# Altium schematic sheet main_controller.SchDoc
size A4; SheetNumber: 3; SheetTotal: 4
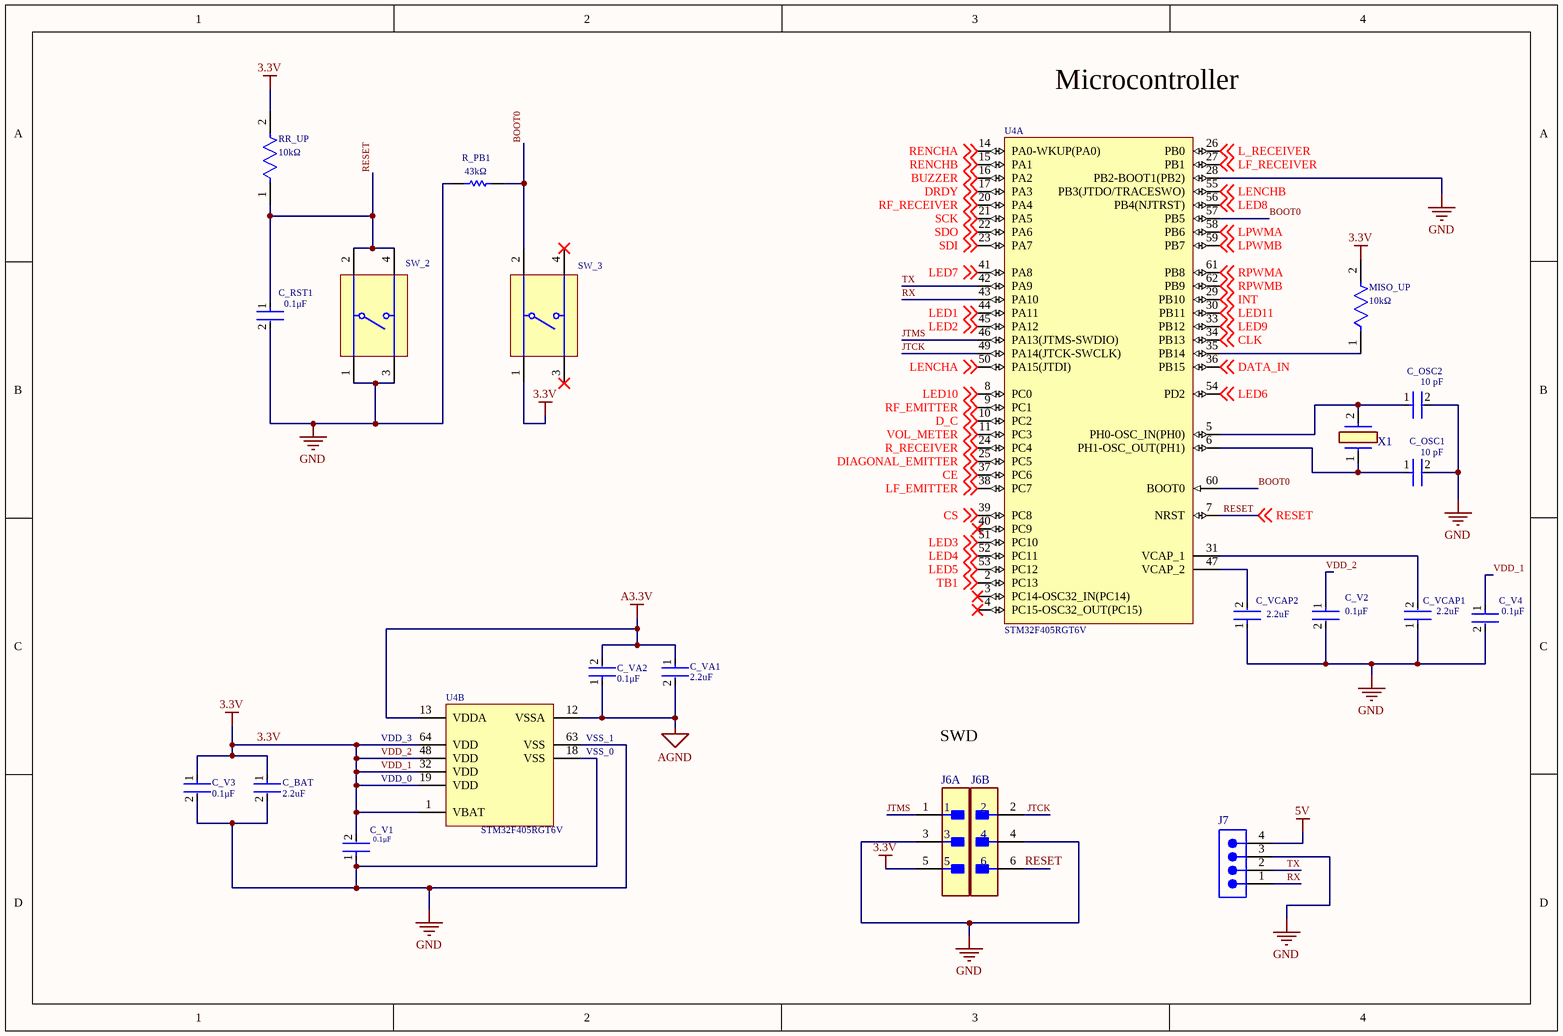
[diagram p0: main_controller.SchDoc]

## Parts
C_BAT  Capacitance: 2.2uF  [FP-C2012-125-0_2-IPC_C]  (hidden comment: C2012X5R1H225K125AB)
C_OSC1  value 10 pF  [FP-C0805C-DN-MFG]  (hidden comment: C0805C100K5GACTU)
C_OSC2  value 10 pF  [FP-C0805C-DN-MFG]  (hidden comment: C0805C100K5GACTU)
C_RST1  value 0.1μF  [FP-C0805C-DN-MFG]  (hidden comment: C0805C104J8RACTU)
C_V1  value 0.1μF  [FP-C0805C-DN-MFG]  (hidden comment: C0805C104J8RACTU)
C_V2  value 0.1μF  [FP-C0805C-DN-MFG]  (hidden comment: C0805C104J8RACTU)
C_V3  value 0.1μF  [FP-C0805C-DN-MFG]  (hidden comment: C0805C104J8RACTU)
C_V4  value 0.1μF  [FP-C0805C-DN-MFG]  (hidden comment: C0805C104J8RACTU)
C_VA1  Capacitance: 2.2uF  [FP-C2012-125-0_2-IPC_C]  (hidden comment: C2012X5R1H225K125AB)
C_VA2  value 0.1μF  [FP-C0805C-DN-MFG]  (hidden comment: C0805C104J8RACTU)
C_VCAP1  Capacitance: 2.2uF  [FP-C2012-125-0_2-IPC_C]  (hidden comment: C2012X5R1H225K125AB)
C_VCAP2  Capacitance: 2.2uF  [FP-C2012-125-0_2-IPC_C]  (hidden comment: C2012X5R1H225K125AB)
J6  90131-0763  [FP-90131-0763-MFG]  (value not drawn)  (parts A,B of 2)
J7  61300411121  [61300411121]  (value not drawn)
MISO_UP  value 10kΩ  [FP-ERA3A-IPC_C]  (hidden comment: ERA-3AEB103V)
R_PB1  value 43kΩ  [RESC1608X55X30NL20T20]  (hidden comment: ERA3AEB433V)
RR_UP  value 10kΩ  [FP-ERA3A-IPC_C]  (hidden comment: ERA-3AEB103V)
SW_2  1825910-6  [TECO-1825910-6_V]  (value not drawn)
SW_3  1825910-6  [TECO-1825910-6_V]  (value not drawn)
U4  STM32F405RGT6V  [STM-LQFP64_V]  (parts A,B of 2)
X1  NX5032GA-16.000M-LN-CD-1  [NX5032GA16000000MHZLNCD1]  (value not drawn)

## Nets
3.3V: C_BAT.1 C_V1.2 C_V2.1 C_V3.1 C_V4.1 J6.5 MISO_UP.2 RR_UP.2 SW_3.1 U4.1(VBAT) U4.19(VDD) U4.32(VDD) U4.48(VDD) U4.64(VDD)  [also labelled VDD_1, VDD_2]
5V: J7.4
A3.3V: C_VA1.1 C_VA2.2 U4.13(VDDA)
AGND: C_VA1.2 C_VA2.1 U4.12(VSSA)
GND: C_BAT.2 C_OSC1.2 C_OSC2.2 C_RST1.2 C_V1.1 C_V2.2 C_V3.2 C_V4.2 C_VCAP1.1 C_VCAP2.1 J6.3 J6.4 J7.3 R_PB1.2 SW_2.1 SW_2.3 U4.18(VSS) U4.28(PB2-BOOT1(PB2)) U4.63(VSS)
BOOT0: R_PB1.1 SW_3.2 U4.57(PB5) U4.60(BOOT0)
BUZZER: U4.16(PA2) ; off-sheet BUZZER
CE: U4.37(PC6) ; off-sheet CE
CLK: U4.34(PB13) ; off-sheet CLK
CS: U4.39(PC8) ; off-sheet CS
D_C: U4.10(PC2) ; off-sheet D_C
DATA_IN: U4.36(PB15) ; off-sheet DATA_IN
DIAGONAL_EMITTER: U4.25(PC5) ; off-sheet DIAGONAL_EMITTER
DRDY: U4.17(PA3) ; off-sheet DRDY
INT: U4.29(PB10) ; off-sheet INT
JTCK: J6.2 U4.49(PA14(JTCK-SWCLK))
JTMS: J6.1 U4.46(PA13(JTMS-SWDIO))
L_RECEIVER: U4.26(PB0) ; off-sheet L_RECEIVER
LED1: U4.44(PA11) ; off-sheet LED1
LED2: U4.45(PA12) ; off-sheet LED2
LED3: U4.51(PC10) ; off-sheet LED3
LED4: U4.52(PC11) ; off-sheet LED4
LED5: U4.53(PC12) ; off-sheet LED5
LED6: U4.54(PD2) ; off-sheet LED6
LED7: U4.41(PA8) ; off-sheet LED7
LED8: U4.56(PB4(NJTRST)) ; off-sheet LED8
LED9: U4.33(PB12) ; off-sheet LED9
LED10: U4.8(PC0) ; off-sheet LED10
LED11: U4.30(PB11) ; off-sheet LED11
LENCHA: U4.50(PA15(JTDI)) ; off-sheet LENCHA
LENCHB: U4.55(PB3(JTDO/TRACESWO)) ; off-sheet LENCHB
LF_EMITTER: U4.38(PC7) ; off-sheet LF_EMITTER
LF_RECEIVER: U4.27(PB1) ; off-sheet LF_RECEIVER
LPWMA: U4.58(PB6) ; off-sheet LPWMA
LPWMB: U4.59(PB7) ; off-sheet LPWMB
R_RECEIVER: U4.24(PC4) ; off-sheet R_RECEIVER
RENCHA: U4.14(PA0-WKUP(PA0)) ; off-sheet RENCHA
RENCHB: U4.15(PA1) ; off-sheet RENCHB
RESET: C_RST1.1 J6.6 RR_UP.1 SW_2.2 SW_2.4 U4.7(NRST) ; off-sheet RESET
RF_EMITTER: U4.9(PC1) ; off-sheet RF_EMITTER
RF_RECEIVER: U4.20(PA4) ; off-sheet RF_RECEIVER
RPWMA: U4.61(PB8) ; off-sheet RPWMA
RPWMB: U4.62(PB9) ; off-sheet RPWMB
RX: J7.1 U4.43(PA10)
SCK: U4.21(PA5) ; off-sheet SCK
SDI: U4.23(PA7) ; off-sheet SDI
SDO: U4.22(PA6) ; off-sheet SDO
TB1: U4.2(PC13) ; off-sheet TB1
TX: J7.2 U4.42(PA9)
VOL_METER: U4.11(PC3) ; off-sheet VOL_METER
NetC_OSC1_1: C_OSC1.1 U4.6(PH1-OSC_OUT(PH1)) X1.1(X1)
NetC_OSC2_1: C_OSC2.1 U4.5(PH0-OSC_IN(PH0)) X1.2(X2)
NetC_VCAP1_2: C_VCAP1.2 U4.31(VCAP_1)
NetC_VCAP2_2: C_VCAP2.2 U4.47(VCAP_2)
NetMISO_UP_1: MISO_UP.1 U4.35(PB14)

Not connected (* = marked no-connect by the designer): SW_3 3* 4*; U4 3(PC14-OSC32_IN(PC14))* 4(PC15-OSC32_OUT(PC15))* 40(PC9)*

## Notes on the sheet
- Microcontroller
- VDD_0
- (near U4) VDD_3
- (near U4) VSS_0
- (near U4) VSS_1
- SWD

## Library data of the parts
C_BAT C_VA1 C_VCAP1 C_VCAP2 = CMP-08246-005698-1: Multilayer Ceramic Capacitors 2.2μF ±10% 50V X5R SMD 0805; Insulation Resistance: 10GR; Dissipation Factor: 5%; Width: 1.2mm; Packaging: Tape and Reel; REACH SVHC: No SVHC; Dielectric: X5R; Dielectric Material: Ceramic; Voltage Rating: 50V; Radiation Hardening: No; Height: 1.25mm; Termination: SMD/SMT; Max Operating Temperature: 85°C; Resistor Type: Ceramic; Package Quantity: 1; Min Operating Temperature: -55°C; Weight: 0.000194oz; Thickness: 0.057inch; Lead Free: Lead Free; Tolerance: 10%; Voltage Rating (DC): 50V; RoHS Compliant: Yes; Construction: Flat; Mount: Surface Mount; Depth: 1.25mm; Length: 2mm; Case Code (Imperial): 0805; Case/Package: 0805; Series: C; Case Code (Metric): 2012
C_OSC1 C_OSC2 = CMP-2007-00462-2: CAP CER 10PF 50V 10% NP0 0805; Manufacturer: KEMET; Temperature Characteristic: C0G; Temperature Coefficient: 30ppm/°C; Tolerance: 0.1; Package: C0805C-DN; Device Class L2: Capacitors; Mouser Description: Multilayer Ceramic Capacitors MLCC - SMD/SMT 50volts 10pF C0G 10%; ComponentLink2URL: https://content.kemet.com/datasheets/KEM_C1003_C0G_SMD.pdf; Automotive: No; Device Class L3: Ceramic Capacitors; Temperature: -55°C to +125°C; Manufacturer Part Number: C0805C100K5GACTU; Digikey Description: CAP CER 10PF 50V 10% NP0 0805; Material: Ceramic; RoHS: TRUE; Temperature Range High: +125°C; Capacitance: 10 pF; Category: Cap; Voltage Rating: 50 V; Octopart: https://octopart.com/c0805c100k5gactu-kemet-8089747; Height: 0.88mm; Lead Free: Yes; Ipc Land Pattern Name: CAPC200125X78; Temperature Range Low: -55°C; Device Class L1: Passive Components; ComponentLink2Description: Datasheet
C_RST1 C_V1-C_V4 C_VA2 = CMP-03020-032188-1: CAP CER 0.1UF 10V 5% X7R 0805; Manufacturer: KEMET; Tolerance: 0.05; Capacitance: 0.10 μF; Temperature Coefficient: 30ppm/°C; Package: C0805C-DN; Device Class L1: Passive Components; Temperature: -55°C to +125°C; Category: Cap; RoHS: TRUE; Mouser Description: Multilayer Ceramic Capacitors MLCC - SMD/SMT 10volts 0.1uF X7R 5%; Lead Free: Yes; Temperature Range Low: -55°C; Material: Ceramic; Temperature Range High: +125°C; Device Class L2: Capacitors; Temperature Characteristic: X7R; Device Class L3: Ceramic Capacitors; ComponentLink2Description: Datasheet; Automotive: No; Ipc Land Pattern Name: CAPC200125X78; Manufacturer Part Number: C0805C104J8RACTU; Voltage Rating: 10 V; Height: 0.88mm; Digikey Description: CAP CER 0.1UF 10V 5% X7R 0805; Octopart: https://octopart.com/c0805c104j8ractu-kemet-11807087; ComponentLink2URL: https://content.kemet.com/datasheets/KEM_C1003_C0G_SMD.pdf
J6 = CMP-00257-00655468-1: 90131-0763 Conn Unshrouded Header HDR 6 POS 2.54mm Solder ST Top Entry Thru-Hole C-Grid III™ Tray; NexarPartId: 655468; Manufacturer Lifecycle Status: ACTIVE; Number of Poles: 6; Plating: Tin; Current Rating: 3A; Gender: Male; Voltage Rating (AC): 350V; Contact Resistance: 20mΩ; Insulation Resistance: 5GΩ; Pitch: 2.54mm; Height: 9.65mm; Mount: Through Hole; Termination: Through Hole; Contact Plating: Gold; Orientation: Vertical; Material: Glass, Polyester; Min Operating Temperature: -55°C; Lead Free: Lead Free; REACH SVHC: Unknown; Contact Material: Brass; Housing Color: Black; Schedule B: 8536694040; Number of Rows: 2; Lead Pitch: 2.54mm; Number of Circuits: 6; Number of Positions: 6; Lifecycle Status: Production; Max Operating Temperature: 125°C; Voltage Rating: 350V; Voltage Rating (DC): 350V; Country of Origin: SG; Housing Material: Polyester; RoHS: Compliant; Working Voltage: 350V; Number of Contacts: 6; Radiation Hardening: No
J7 = CMP-1502-01064-2: NexarPartId: 32855522; Pitch: 2.54mm; Number of Contacts: 4; Contact Resistance: 20mΩ; Gender: Male; Current Rating: 3A; Connector Type: Male Pin; Voltage Rating: 250V; Lead Free: Lead Free; Contact Plating: Gold; Max Operating Temperature: 105°C; Packaging: Bulk; Height: 8.89mm; Orientation: Vertical; Contact Mating Length: 5.9944mm; Contact Material: Copper; Lead Pitch: 2.54mm; Min Operating Temperature: -40°C; Termination: Solder; Color: Black; Number of Rows: 1; REACH SVHC: Unknown; RoHS: Compliant; Mount: Through Hole; Number of Positions: 4; Number of Pins: 4; Operating Supply Voltage: 250V
MISO_UP RR_UP = CMP-2000-00874-2: RES SMD 10K OHM 0.1% 1/10W 0603; Voltage Rating (DC): 75V; Power Rating: 100mW; Resistance: 10kR; Temperature Coefficient: 25ppm/°C; Radiation Hardening: No; Width: 0.8mm; Depth: 0.8mm; Construction: Rectangular; Case Code (Metric): 1608; Package Quantity: 5000; Length: 1.6mm; Size Code: 0603; Case Code (Imperial): 0603; Termination: SMD/SMT; Contact Plating: Tin; Resistance Tolerance: 0.1%; Military Standard: Not; Packaging: Tape and Reel; Max Power Dissipation: 100mW; REACH SVHC: No SVHC; Series: ERA-3A; Voltage Rating: 75V; Lead Free: Lead Free; Technology: METAL FILM; RoHS Compliant: Yes; Max Operating Temperature: 155°C; Resistor Type: Thin Film; Min Operating Temperature: -55°C; Number of Pins: 2; Case/Package: 0603; Tolerance: 0.1%; Height: 0.45mm; Mount: Surface Mount; Number of Terminations: 2
R_PB1 = CMP-2000-00064-1: Manufacturer: Panasonic; Part Number: ERA3AEB433V; Resistance: 43kΩ
SW_2 SW_3 = CMP-1684-00021-1: Tact Switch, SPST-NO, 0.05 A, -35 to 85 degC, 4-Pin THD, RoHS, Bulk; Manufacturer: TE Connectivity; Maximum Contact Resistance: 100mOhm; Mechanical Life: 100000Cycles; Bushing Type: Unthreaded; Switch Configuration: OFF(ON); Maximum DC Voltage Rating: 24V; Contact Rating @ Voltage: 0.05A@24VDC; Actuator Color: Black; Body Orientation: Straight; Function: MomentaryContact; Illumination: N/R; Actuator Style: RoundButton; Actuator Material: PolybutyleneTerephthalate; Dielectric Strength: 500VAC; Pole Throw Configuration: SPST; Actuator Length: 1.4mm; Product Weight: N/A; Contact Material: CopperAlloy; Housing Material: N/A; Terminal Type: PCPins; Minimum Insulation Resistance: 100MOhm; Package Description: 4-Pin Through Hole Device, Body 5.99 x 5.99 mm, Pitch 6.5 mm; Part No: 1825910-6; Package Reference: THD; Base Material: N/A; Manufacturer URL: http://www.te.com; Contact Plating: Silver; RoHS: Yes; Datasheet Version: Rev. C9; Electrical Life: 100000Cycles; Maximum AC Voltage Rating: N/A; Thread Size: N/R; Operating Temperature: -35to85C; Mounting: ThroughHole; Dimension: 5.99x5mm; Datasheet URL: http://www.te.com/commerce/DocumentDelivery/DDEController?Action=showdoc&DocId=Customer+Drawing%7F1825910%7FC9%7Fpdf%7FEnglish%7FENG_CD_1825910_C9.pdf%7F1825910-6; Family: 1825910; Seal Location: N/A; Seal Description: N/A; Packaging: N/A
U4 = CMP-0243-00092-2: ARM Cortex-M4 32-bit MCU+FPU, 210 DMIPS, 1024 kB Flash, 192 kB Internal RAM, 51 I/Os, 64-pin LQFP, -40 to 85 degC, Tray; Manufacturer: STMicroelectronics; FLASH Size (Prog) (kB): 1024; D/A Converter: 2x12-bit; Supply Voltage(Vcc) min (V): 1.8; Operating Frequency(F) (Processor speed) (MHz): 168; Internal RAM Size (kB): 192; Supply Voltage(Vcc) max (V): 3.6; I/Os (High Current): 51; ComponentLink2URL: http://www.st.com/st-web-ui/static/active/en/resource/technical/document/datasheet/DM00037051.pdf; ComponentLink3URL: http://www.st.com/st-web-ui/static/active/en/resource/technical/document/datasheet/DM00037051.pdf; Mounting Technology: Surface Mount; PackageReference: LQFP64; ComponentLink2Description: Datasheet; Core: ARM Cortex-M4; ComponentLink1Description: Manufacturer URL; ComponentLink1URL: http://www.st.com/web/en/home.html; PartNumber: STM32F405RGT6V; PackageVersion: Rev. 4, 06/2013; Packing: Tray; DatasheetVersion: Rev. 4; PackageDescription: 64-Pin Low Profile Quad Flat Package, 10 x 10 mm Body, 0.5 mm Pitch; ComponentLink3Description: Package Specification
X1 = NX5032GA-16.000M-LN-CD-1: Crystal or Oscillator; Manufacturer_Name: NDK; Datasheet Link: https://media.digikey.com/pdf/Data%20Sheets/NDK%20PDFs/NX5032GA.pdf; Height: 1.5mm; Manufacturer_Part_Number: NX5032GA-16.000M-LN-CD-1; Mouser Part Number: 344-NX5032GA16MLNCD1; Mouser Price/Stock: https://www.mouser.co.uk/ProductDetail/NDK/NX5032GA-16.000M-LN-CD-1?qs=55YtniHzbhDnyNixVDBwYw%3D%3D